# EAGLE design IMU board V4 (EAGLE 7.1.0)
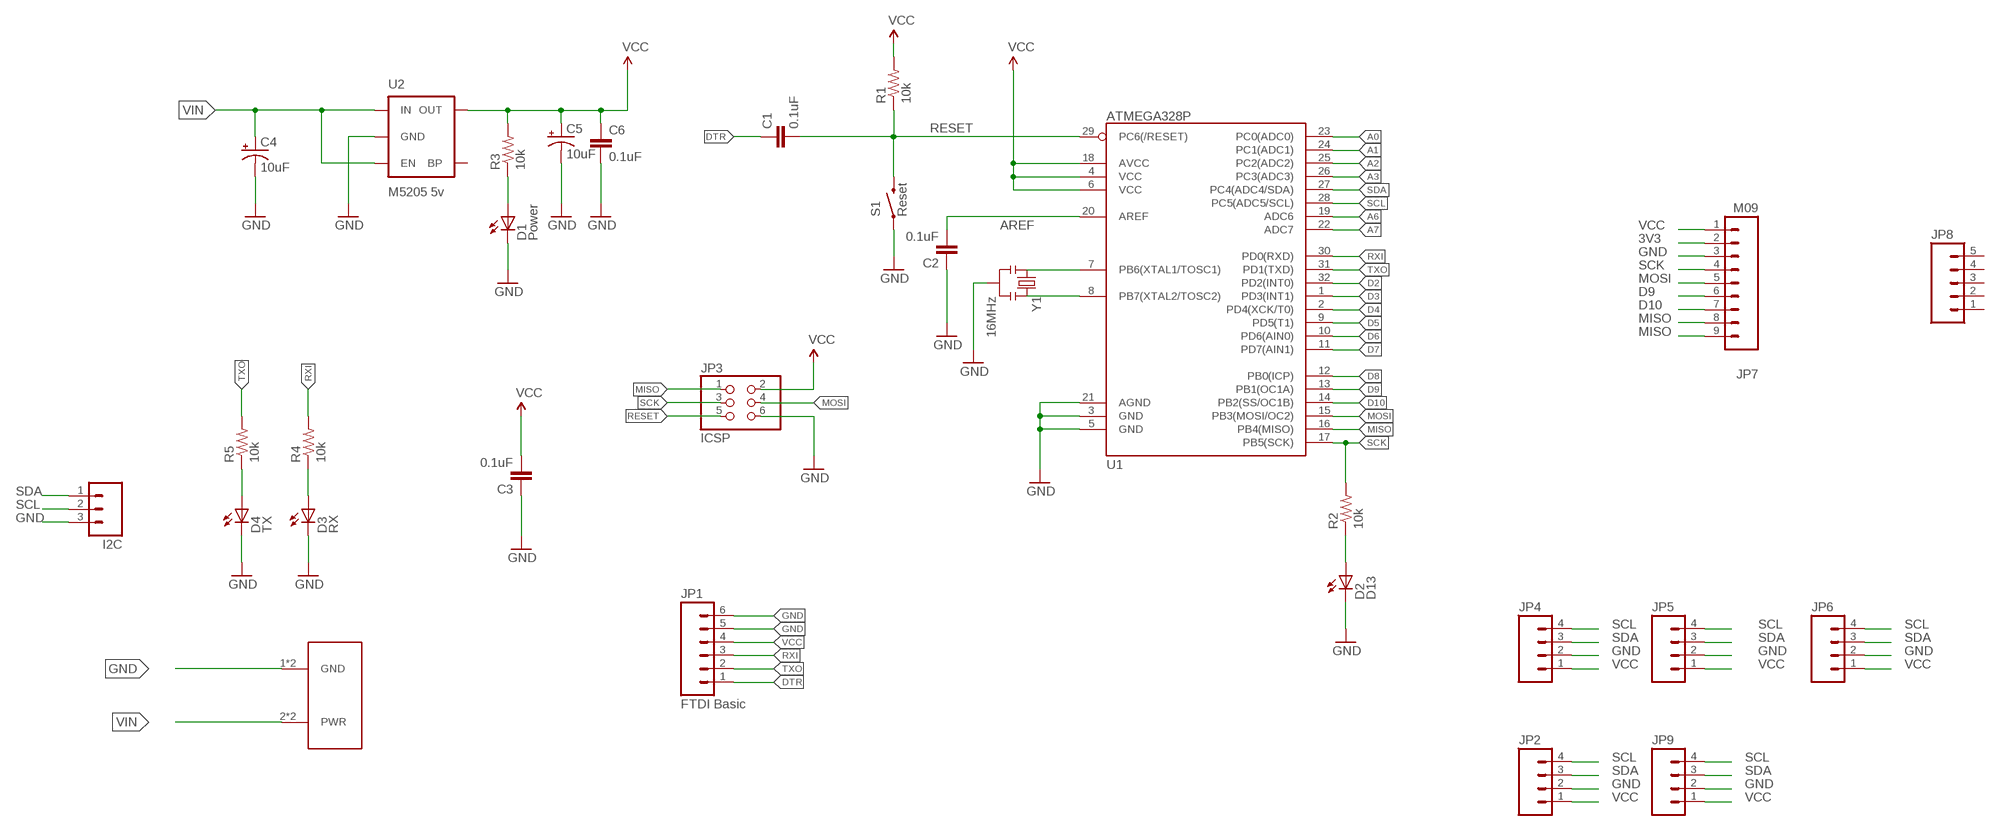
[diagram p0: schematic, sheet 1]

## Parts
C1  0.1uF  CAP0603-CAP  [0603-CAP]
C2  0.1uF  CAP0603-CAP  [0603-CAP]
C3  0.1uF  CAP0603-CAP  [0603-CAP]
C4  10uF  CAP_POL1206  [EIA3216]
C5  10uF  CAP_POL1206  [EIA3216]
C6  0.1uF  CAP0603-CAP  [0603-CAP]
D1  Power  LED-RED0603  [LED-0603]
D2  D13  LED-RED0603  [LED-0603]
D3  RX  LED-GREEN0603  [LED-0603]
D4  TX  LED-RED0603  [LED-0603]
I2C  M03PTH  [1X03]
JP1  FTDI Basic  M06SIP  [1X06]
JP2  M04PTH  [1X04]
JP3  ICSP  PINHD-2X3  [2X03]
JP4  M04PTH  [1X04]
JP5  M04PTH  [1X04]
JP6  M04PTH  [1X04]
JP7  M09  [1X09]
JP8  M05PTH  [1X05]
JP9  M04PTH  [1X04]
R1  10k  RESISTOR0603-RES  [0603-RES]
R2  10k  RESISTOR0603-RES  [0603-RES]
R3  10k  RESISTOR0603-RES  [0603-RES]
R4  10k  RESISTOR0603-RES  [0603-RES]
R5  10k  RESISTOR0603-RES  [0603-RES]
S1  Reset  SWITCH-MOMENTARY-2SMD  [TACTILE_SWITCH_SMD]
U1  ATMEGA328P  ATMEGA328_SMT  [TQFP32-08]
U2  M5205 5v  MIC52055V  [SOT23-5]
U$1  LSF-SMT  [LSF-SMT]
Y1  16MHz  RESONATOR16MHZ  [RESONATOR-SMD]

## Nets
3V3: JP7.2
A0: U1.23(PC0(ADC0))
A1: U1.24(PC1(ADC1))
A2: U1.25(PC2(ADC2))
A3: U1.26(PC3(ADC3))
A6: U1.19(ADC6)
A7: U1.22(ADC7)
AREF: C2.2 U1.20(AREF)
D2: U1.32(PD2(INT0))
D3: U1.1(PD3(INT1))
D4: U1.2(PD4(XCK/T0))
D5: U1.9(PD5(T1))
D6: U1.10(PD6(AIN0))
D7: U1.11(PD7(AIN1))
D8: U1.12(PB0(ICP))
D9: JP7.6 U1.13(PB1(OC1A))
D10: JP7.7 U1.14(PB2(SS/OC1B))
DTR: C1.1 JP1.1
GND: C2.1 C3.1 C4.C(-) C5.C(-) C6.2 D1.C D2.C D3.C D4.C I2C.3 JP1.5 JP1.6 JP2.2 JP3.6 JP4.2 JP5.2 JP6.2 JP7.3 JP9.2 S1.1 U1.3(GND) U1.5(GND) U1.21(AGND) U2.2(GND) U$1.1(GND) U$1.1-2(GND) Y1.2
MISO: JP3.1 JP7.8 JP7.9 U1.16(PB4(MISO))
MOSI: JP3.4 JP7.5 U1.15(PB3(MOSI/OC2))
N$1: U1.7(PB6(XTAL1/TOSC1)) Y1.1
N$2: U1.8(PB7(XTAL2/TOSC2)) Y1.3
N$3: D1.A R3.1
N$4: D2.A R2.1
N$5: D3.A R4.1
N$6: D4.A R5.1
RESET: C1.2 JP3.5 R1.1 S1.3 U1.29(PC6(/RESET))
RXI: JP1.3 R4.2 U1.30(PD0(RXD))
SCK: JP3.3 JP7.4 R2.2 U1.17(PB5(SCK))
SCL: I2C.2 JP2.4 JP4.4 JP5.4 JP6.4 JP9.4 U1.28(PC5(ADC5/SCL))
SDA: I2C.1 JP2.3 JP4.3 JP5.3 JP6.3 JP9.3 U1.27(PC4(ADC4/SDA))
TXO: JP1.2 R5.2 U1.31(PD1(TXD))
VCC: C3.2 C5.A(+) C6.1 JP1.4 JP2.1 JP3.2 JP4.1 JP5.1 JP6.1 JP7.1 JP9.1 R1.2 R3.2 U1.4(VCC) U1.6(VCC) U1.18(AVCC) U2.5(OUT)
VIN: C4.A(+) U2.1(IN) U2.3(EN) U$1.2(PWR) U$1.2-2(PWR)
Unconnected: JP8.1 JP8.2 JP8.3 JP8.4 JP8.5 U2.4(BP)

## Library data of the parts
C1-C3 C6 = SparkFun-Passives:CAP: Capacitor Standard 0603 ceramic capacitor, and 0.1" leaded capacitor.
C4 C5 = SparkFun-Passives:CAP_POL: Capacitor Polarized These are standard SMD and PTH capacitors. Normally 10uF, 47uF, and 100uF in electrolytic and tantalum varieties. Always verify the external diameter of the through hole cap, it varies with capacity, voltage, and manufacturer. The EIA devices should be standard.
D1 D2 D4 = SparkFun-LED:LED-RED: Assorted Red LEDs LilyPad 1206- DIO-09912 1206- DIO-00809 0603- DIO-00819; PROD_ID: DIO-00819; VALUE: RED
D3 = SparkFun-LED:LED-GREEN: Various green LEDs Green LEDs used in SFE Production 0603- DIO-00821 LARGE- DIO-00862 LILYPAD- DIO-09910; PROD_ID: DIO-00821; VALUE: GREEN
I2C = SparkFun-Connectors:M03: Header 3 Standard 3-pin 0.1" header. Use with straight break away headers (SKU : PRT-00116), right angle break away headers (PRT-00553), swiss pins (PRT-00743), machine pins (PRT-00117), and female headers (PRT-00115). Molex polarized connector foot print use with SKU : PRT-08232 with associated crimp pins and housings.
JP1 = SparkFun-Connectors:M06: Header 6 Standard 6-pin 0.1" header. Use with straight break away headers (SKU : PRT-00116), right angle break away headers (PRT-00553), swiss pins (PRT-00743), machine pins (PRT-00117), and female headers (PRT-00115). Molex polarized connector foot print use with SKU : PRT-08094 with associated crimp pins and housings. NOTES ON THE VARIANTS LOCK and LOCK_LONGPADS... This footprint was designed to help hold the alignment of a through-hole component (i.e. 6-pin header) while soldering it into place. You may notice that each hole has been shifted either up or down by 0.005 of an inch from it's more standard position (which is a perfectly straight line). This slight alteration caused the pins (the squares in the middle) to touch the edges of the holes. Because they are alternating, it causes a "brace" to hold the component in place. 0.005 has proven to be the perfect amount of "off-center" position when using our standard breakaway headers. Although looks a little odd when you look at the bare footprint, once you have a header in there, the alteration is very hard to notice. Also,if you push a header all the way into place, it is covered up entirely on the bottom side. This idea of altering the position of holes to aid alignment will be further integrated into the Sparkfun Library for other footprints. It can help hold any component with 3 or more connection pins.
JP2 JP4-JP6 JP9 = SparkFun-Connectors:M04: Header 4 Standard 4-pin 0.1" header. Use with straight break away headers (SKU : PRT-00116), right angle break away headers (PRT-00553), swiss pins (PRT-00743), machine pins (PRT-00117), and female headers (PRT-00115). Molex polarized connector foot print use with SKU : PRT-08231 with associated crimp pins and housings. 1MM SMD Version SKU: PRT-10208
JP3 = SparkFun-Connectors:PINHD-2X3: PIN HEADER
JP7 = SparkFun-Connectors:M09: Header 9 Standard 9-pin 0.1" header. Use with straight break away headers (SKU : PRT-00116), right angle break away headers (PRT-00553), swiss pins (PRT-00743), machine pins (PRT-00117), and female headers (PRT-00115).
JP8 = SparkFun-Connectors:M05: Header 5 Standard 5-pin 0.1" header. Use with straight break away headers (SKU : PRT-00116), right angle break away headers (PRT-00553), swiss pins (PRT-00743), machine pins (PRT-00117), and female headers (PRT-00115). Molex polarized connector foot print use with SKU : PRT-08230 with associated crimp pins and housings.
R1-R5 = SparkFun-Passives:RESISTOR: Resistor Basic schematic elements and footprints for 0603, 1206, and PTH resistors.
S1 = SparkFun-Electromechanical:SWITCH-MOMENTARY-2: Various NO switches- pushbuttons, reed, etc; PROD_ID: SWCH-08247
U1 = SparkFun-DigitalIC:ATMEGA328_SMT: 32-Pin Atmega328 part Commonly used on Arduino compatible boards Available in QFP and QFN packages TQFP is IC-09069 QFN is non-stock; PROD_ID: IC-09069
U2 = SparkFun-PowerIC:MIC5205: MIC5205 150mA vreg 3.3V - VREG-00822 5V - VREG-00823; PROD_ID: VREG-00823
U$1 = LSF-SMT:LSF-SMT
Y1 = SparkFun-FreqCtrl:RESONATOR: Resonator Small SMD resonator. Used, eg, on the Arduino Pro/ Pro Mini boards. 8MHz- XTAL-08895 16MHz- XTAL-08900; PROD_ID: XTAL-08900

## Board
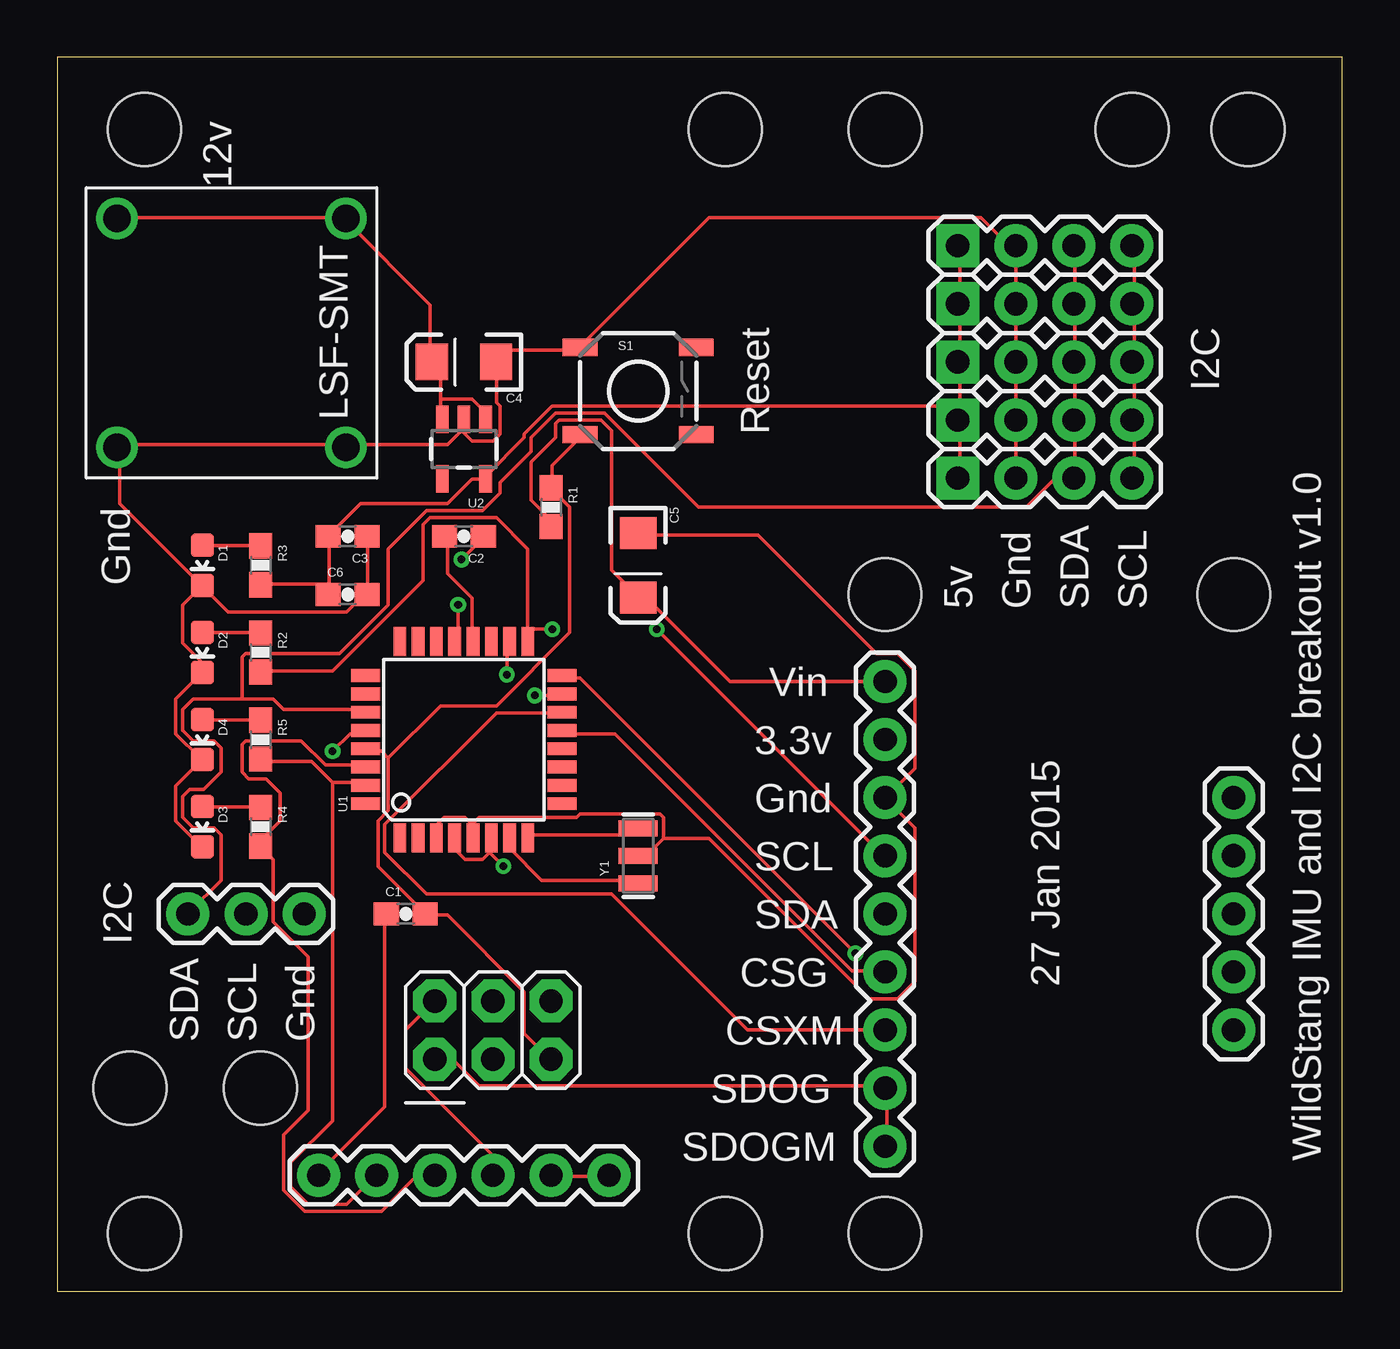
[diagram p1: board, top side]
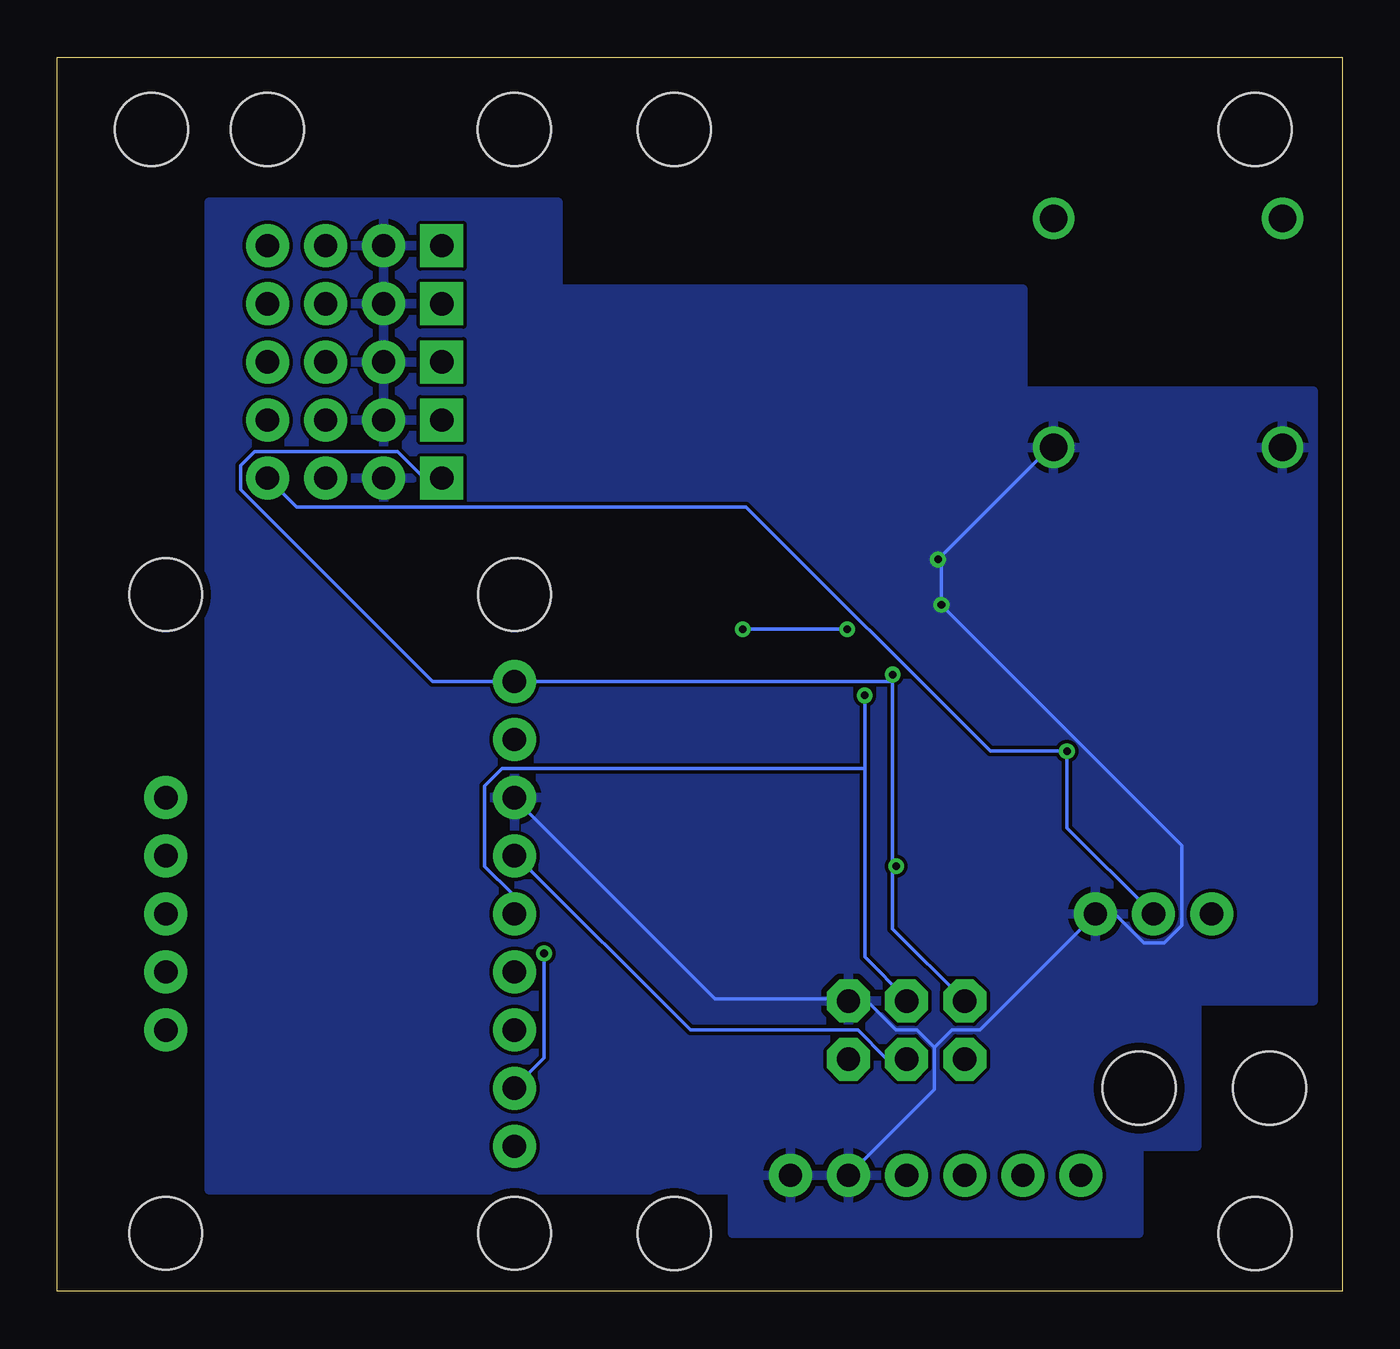
[diagram p2: board, bottom side, seen from below]

Size 56.19 x 53.97 mm. Coordinates in mm from the lower left corner, seen from the top.
Outline: 0,0 56.19,0 56.19,53.97 0,53.97 0,0
Copper layers (1*16): Top 0.0356mm / dielectric 1.5011mm / Bottom 0.0356mm
Design rules "LaenPCBOrder": minimum track width 6mil, minimum drill 13mil, track to track 6mil, track to pad 6mil, pad to pad 6mil, via to via 6mil, smd to smd 6mil, copper to edge 15mil, drill to drill 6mil, minimum pad ring 7mil, minimum via ring 7mil, stop-mask expansion 3mil, vias tented up to drill 0mil, thermal gap 10mil
Holes 3.2 mm at 3.81,2.54 29.21,2.54 3.81,50.8 29.21,50.8 52.07,50.8 3.17,8.89 8.89,8.89 36.2,50.8 46.99,50.8
Holes 3.17 mm at 36.2,30.48 51.44,30.48 36.2,2.54 51.44,2.54

### Footprints (pad centres in the part's own frame; a part is rotated, then mirrored left to right if it is on the bottom)
0603-CAP = smd 1.1 x 1: 1 -0.85,0; 2 0.85,0
EIA3216 = smd 1.4 x 1.6: A 1.4,0; C -1.4,0
LED-0603 = smd 1 x 1: A 0,-0.877; C 0,0.877
1X03 = drill 1.016 pad 1.88: 1 0,0; 2 2.54,0; 3 5.08,0
1X06 = drill 1.016 pad 1.88: 1 0,0; 2 2.54,0; 3 5.08,0; 4 7.62,0; 5 10.16,0; 6 12.7,0
1X04 = drill 1.016 pad 1.88 square: 1 0,0 | drill 1.016 pad 1.88: 2 2.54,0; 3 5.08,0; 4 7.62,0
2X03 = drill 1.016 pad 1.88 octagon: 1 -2.54,-1.27; 2 -2.54,1.27; 3 0,-1.27; 4 0,1.27; 5 2.54,-1.27; 6 2.54,1.27
1X09 = drill 1.016 pad 1.88: 1 0,0; 2 2.54,0; 3 5.08,0; 4 7.62,0; 5 10.16,0; 6 12.7,0; 7 15.24,0; 8 17.78,0; 9 20.32,0
1X05 = drill 1.016 pad 1.88: 1 0,0; 2 2.54,0; 3 5.08,0; 4 7.62,0; 5 10.16,0
0603-RES = smd 1.1 x 1: 1 -0.85,0; 2 0.85,0
TACTILE_SWITCH_SMD = smd 1.524 x 0.762: 1 -2.54,1.905; 2 2.54,1.905; 3 -2.54,-1.905; 4 2.54,-1.905
TQFP32-08 = smd 1.27 x 0.559: 1 -4.293,2.8; 2 -4.293,2; 3 -4.293,1.2; 4 -4.293,0.4; 5 -4.293,-0.4; 6 -4.293,-1.2; 7 -4.293,-2; 8 -4.293,-2.8; 17 4.293,-2.8; 18 4.293,-2; 19 4.293,-1.2; 20 4.293,-0.4; 21 4.293,0.4; 22 4.293,1.2; 23 4.293,2; 24 4.293,2.8 | smd 0.559 x 1.27: 9 -2.8,-4.293; 10 -2,-4.293; 11 -1.2,-4.293; 12 -0.4,-4.293; 13 0.4,-4.293; 14 1.2,-4.293; 15 2,-4.293; 16 2.8,-4.293; 25 2.8,4.293; 26 2,4.293; 27 1.2,4.293; 28 0.4,4.293; 29 -0.4,4.293; 30 -1.2,4.293; 31 -2,4.293; 32 -2.8,4.293
SOT23-5 = smd 0.55 x 1.2: 1 -0.95,-1.3; 2 0,-1.3; 3 0.95,-1.3; 4 0.95,1.3; 5 -0.95,1.3
LSF-SMT = drill 1.199: 1 -5.004,5.004; 1-2 -5.004,-5.004; 2 5.004,5.004; 2-2 5.004,-5.004
RESONATOR-SMD = smd 0.7 x 1.7: 1 -1.2,0; 2 0,0; 3 1.2,0

### Placement (x,y rotation side)
C1  15.24,16.51 0 top
C2  17.78,33.02 180 top
C3  12.7,33.02 180 top
C4  17.78,40.64 180 top
C5  25.4,31.75 270 top
C6  12.7,30.48 0 top
D1  6.35,31.75 180 top
D2  6.35,27.94 180 top
D3  6.35,20.32 180 top
D4  6.35,24.13 180 top
I2C  5.71,16.51 0 top
JP1  11.43,5.08 0 top
JP2  39.37,45.72 0 top
JP3  19.05,11.43 0 top
JP4  39.37,40.64 0 top
JP5  39.37,38.1 0 top
JP6  39.37,35.56 0 top
JP7  36.2,26.67 270 top
JP8  51.44,21.59 270 top
JP9  39.37,43.18 0 top
R1  21.59,34.29 270 top
R2  8.89,27.94 270 top
R3  8.89,31.75 270 top
R4  8.89,20.32 270 top
R5  8.89,24.13 270 top
S1  25.4,39.37 0 top
U1  17.78,24.13 90 top
U2  17.78,36.83 180 top
U$1  7.62,41.91 90 top
Y1  25.4,19.05 90 top

### Tracks (layer width: path | path; a pad name or v marks a point on that pad's centre or on a via)
AREF
  Top 0.152: C2.2 17.07,32.92 17.07,31.39 18.14,30.33 18.14,28.5 U1.20
D9
  Top 0.152: U1.13 22.1,24.38 24.38,24.38 34.75,14.02 36.12,14.02 JP7.6
D10
  Top 0.152: JP7.7 30.18,11.43 24.23,17.37 16.15,17.37 14.33,19.2 14.33,20.42 19.2,25.3 21.95,25.3 U1.14
DTR
  Top 0.152: C1.1 14.33,16.46 14.33,8.08 11.43,5.18 JP1.1
GND  (via drill 0.33)
  Top 0.152: JP1.5 21.64,5.03 24.08,5.03 JP1.6 | 18.14,20.42 17.83,20.73 16.92,20.73 16.61,20.42 16.61,19.96 U1.3 | 18.14,20.42 18.14,19.96 U1.5 18.14,20.42 | Y1.2 25.76,19.05 26.52,19.81 | 26.52,19.81 26.52,20.73 26.36,20.88 22.86,20.88 22.71,20.73 18.44,20.73 18.14,20.42 | C5.C 25.45,33.07 30.63,33.07 35.81,27.89 36.73,27.89 37.49,27.13 37.49,22.86 36.27,21.64 JP7.3 36.27,21.49 37.49,20.27 37.49,13.56 36.73,12.8 35.51,12.8 28.5,19.81 26.52,19.81 | D3.C 6.25,19.51 5.18,20.57 5.18,22.1 6.25,23.16 D4.C 6.25,23.32 5.18,24.38 5.18,25.91 6.25,26.98 D2.C 6.25,27.13 6.25,27.58 5.49,28.35 5.49,30.02 6.25,30.79 D1.C | C3.1 13.56,32.92 13.56,30.48 C6.2 13.41,30.48 12.65,29.72 7.47,29.72 6.4,30.79 D1.C | D1.C 6.25,30.94 2.74,34.44 2.74,36.88 U$1.1 2.74,37.03 12.5,37.03 U$1.1-2 12.65,37.03 17.07,37.03 17.68,37.64 | JP6.2 JP5.2 JP4.2 JP9.2 JP2.2 41.6,45.72 40.39,46.94 28.5,46.94 22.86,41.3 S1.1 22.86,41.15 19.66,41.15 19.2,40.69 C4.C 19.2,40.54 19.2,38.86 19.36,38.71 19.36,37.49 19.05,37.19 18.14,37.19 17.68,37.64 | v17.68,32 18.59,32.92 C2.1 | 17.68,37.64 17.68,38.1 U2.2 17.68,37.64 | v17.53,30.02 17.53,28.5 U1.21
  Bottom 0.152: 17.83,10.67 18.59,11.43 19.51,11.43 20.73,12.65 21.49,12.65 JP3.6 21.64,12.8 27.43,12.8 36.12,21.49 JP7.3 | 17.83,10.67 17.83,8.84 JP1.5 | 17.83,10.67 17.07,11.43 15.85,11.43 10.82,16.46 I2C.3 10.67,16.46 9.91,16.46 8.69,15.24 7.77,15.24 7.01,16 7.01,19.51 v17.53,30.02 17.53,32.16 | 17.53,32.16 12.65,37.03 U$1.1-2 | 17.53,32.16 v17.68,32
  pour Bottom: 1.27,39.37 13.97,39.37 13.97,43.81 34.29,43.81 34.29,46.99 34.29,47.62 49.53,47.62 49.53,4.45 26.67,4.45 26.67,2.54 8.89,2.54 8.89,6.35 6.35,6.35 6.35,6.99 6.35,12.7 1.91,12.7 1.27,12.7
MISO  (via drill 0.33)
  Top 0.152: v34.9,14.78 22.86,26.82 22.1,26.82 U1.16 | JP7.9 36.27,6.4 36.27,8.84 JP7.8 36.12,8.99 18.44,8.99 17.37,10.06 16.61,10.06 JP3.1
  Bottom 0.152: v34.9,14.78 34.9,10.21 36.12,8.99 JP7.8
MOSI  (via drill 0.33)
  Top 0.152: v20.88,26.06 21.95,26.06 U1.15
  Bottom 0.152: 20.88,22.86 20.88,14.63 19.05,12.8 JP3.4 | 20.88,22.86 v20.88,26.06 | 20.88,22.86 36.73,22.86 37.49,22.1 37.49,18.59 36.27,17.37 36.27,16.61 JP7.5
N$1
  Top 0.152: U1.7 19.81,19.81 19.81,19.36 21.18,17.98 25.3,17.98 Y1.1
N$2
  Top 0.152: U1.8 20.73,19.96 25.15,19.96 25.3,20.12 Y1.3
N$3
  Top 0.152: D1.A 6.4,32.61 8.84,32.61 R3.1
N$4
  Top 0.152: D2.A 6.4,28.8 8.84,28.8 R2.1
N$5
  Top 0.152: D3.A 6.4,21.18 8.84,21.18 R4.1
N$6
  Top 0.152: D4.A 6.4,24.99 8.84,24.99 R5.1
RESET
  Top 0.152: S1.3 22.86,37.34 21.64,36.12 21.64,35.2 R1.1 21.64,35.05 22.4,34.29 22.4,28.8 19.2,25.6 16.76,25.6 14.48,23.32 | JP3.5 21.49,10.21 20.42,11.28 20.42,13.11 17.07,16.46 16.15,16.46 C1.2 16,16.61 14.02,18.59 14.02,20.57 14.48,21.03 14.48,23.32 | 14.48,23.32 14.17,23.62 13.56,23.62 U1.29
RXI
  Top 0.152: U1.30 13.41,23.01 11.73,23.01 10.67,24.08 8.23,24.08 8.08,23.93 8.08,22.71 8.38,22.4 9.14,22.4 9.75,21.79 9.75,20.57 8.99,19.81 8.99,19.51 R4.2 8.99,19.36 9.45,18.9 9.45,16.15 10.97,14.63 10.97,7.92 9.91,6.86 9.91,4.42 10.82,3.5 14.17,3.5 15.7,5.03 16.46,5.03 JP1.3
SCK  (via drill 0.33)
  Top 0.152: 20.57,28.96 20.57,28.5 U1.17 20.57,28.96 | 20.57,28.96 20.57,32.46 19.2,33.83 16.31,33.83 16,33.53 16,31.09 12.04,27.13 8.99,27.13 R2.2 | v21.64,28.96 20.57,28.96 | v26.21,28.96 36.12,19.05 JP7.4
  Bottom 0.152: JP3.3 19.05,10.21 19.96,10.21 21.18,11.43 28.5,11.43 36.12,19.05 JP7.4 | v26.21,28.96 v21.64,28.96
SCL  (via drill 0.33)
  Top 0.152: v12.04,23.62 12.8,24.38 13.41,24.38 U1.28 | 47.09,38.1 47.09,35.66 JP6.4 | JP2.4 47.09,45.72 47.09,43.28 JP9.4 47.09,43.13 47.09,40.69 JP4.4 47.09,40.54 47.09,38.1 | 47.09,38.1 JP5.4
  Bottom 0.152: I2C.2 8.38,16.61 12.04,20.27 v12.04,23.62 15.39,23.62 26.06,34.29 45.72,34.29 JP6.4
SDA
  Top 0.152: 44.5,38.1 44.5,35.66 JP6.3 44.35,35.51 43.59,35.51 42.37,34.29 28.04,34.29 23.93,38.41 21.79,38.41 20.73,37.34 20.73,36.73 19.36,35.36 19.36,34.9 18.59,34.14 16.15,34.14 14.48,32.46 14.48,30.02 12.34,27.89 8.23,27.89 8.08,27.74 8.08,25.91 | JP2.3 44.5,45.72 44.5,43.28 JP9.3 44.5,43.13 44.5,40.69 JP4.3 44.5,40.54 44.5,38.1 | 44.5,38.1 JP5.3 | 8.08,25.91 5.94,25.91 5.49,25.45 5.49,24.54 5.94,24.08 6.86,24.08 7.16,23.77 7.16,22.71 6.4,21.95 5.79,21.95 5.49,21.64 5.49,20.73 5.94,20.27 6.86,20.27 7.16,19.96 7.16,17.98 5.79,16.61 I2C.1 | 8.08,25.91 9.45,25.91 9.91,25.45 13.41,25.45 U1.27
TXO
  Top 0.152: 12.04,22.25 11.12,23.16 8.99,23.16 R5.2 | 12.04,22.25 13.41,22.25 U1.31 | 12.04,22.25 12.04,7.47 10.21,5.64 10.21,4.57 10.97,3.81 12.65,3.81 13.87,5.03 JP1.2
VCC  (via drill 0.33)
  Top 0.152: 11.89,30.94 11.89,32.92 C3.2 11.89,33.07 13.26,34.44 17.07,34.44 18.14,35.51 18.59,35.51 U2.5 18.75,35.66 20.42,37.34 20.42,37.49 21.64,38.71 39.47,38.71 | 11.89,30.94 11.89,30.48 C6.1 11.89,30.94 | 11.89,30.94 8.99,30.94 R3.2 | 39.47,38.1 39.47,35.66 JP6.1 | JP2.1 39.47,45.72 39.47,43.28 JP9.1 39.47,43.13 39.47,40.69 JP4.1 39.47,40.54 39.47,38.71 | 39.47,38.71 39.47,38.1 | 39.47,38.1 JP5.1 39.47,38.71 | R1.2 21.49,33.53 21.49,33.83 20.73,34.59 20.73,36.27 21.79,37.34 21.79,37.95 21.95,38.1 23.77,38.1 24.23,37.64 24.23,31.55 25.3,30.48 C5.A 25.45,30.33 25.76,30.33 29.41,26.67 JP7.1 | 18.9,19.2 18.59,18.9 17.83,18.9 17.53,19.2 17.53,19.81 U1.4 | 18.9,19.2 18.9,19.81 U1.6 | v19.66,26.98 19.66,28.35 U1.18 | v19.51,18.59 18.9,19.2 | JP1.4 19.05,5.94 15.24,9.75 15.24,11.43 JP3.2
  Bottom 0.152: 19.66,18.59 19.66,15.85 JP3.2 | 19.66,18.59 19.66,26.67 | 19.66,18.59 v19.51,18.59 | 19.66,26.67 JP7.1 39.78,26.67 48.16,35.05 48.16,36.12 47.55,36.73 41.3,36.73 40.23,35.66 39.47,35.66 JP6.1 | 19.66,26.67 v19.66,26.98
VIN
  Top 0.152: 16.76,39.01 16.76,40.23 16.46,40.54 C4.A 16.31,40.69 16.31,43.13 12.65,46.79 U$1.2-2 12.5,46.94 2.74,46.94 U$1.2 | 16.76,39.01 16.76,38.25 U2.3 | 16.76,39.01 18.14,39.01 18.59,38.56 18.59,38.25 U2.1

### Text on the board
tPlace: 12v | I2C | Reset | Gnd | 5v | Gnd | SDA | SCL | Vin | 3.3v | Gnd | SCL | SDA | CSG | 27 Jan 2015 | SDA | SCL | Gnd | CSXM | SDOG | SDOGM | WildStang IMU and I2C breakout v1.0